# EasyEDA Pro project ProPrj_Embedded Tools_2024-10-02.epro, board Communication
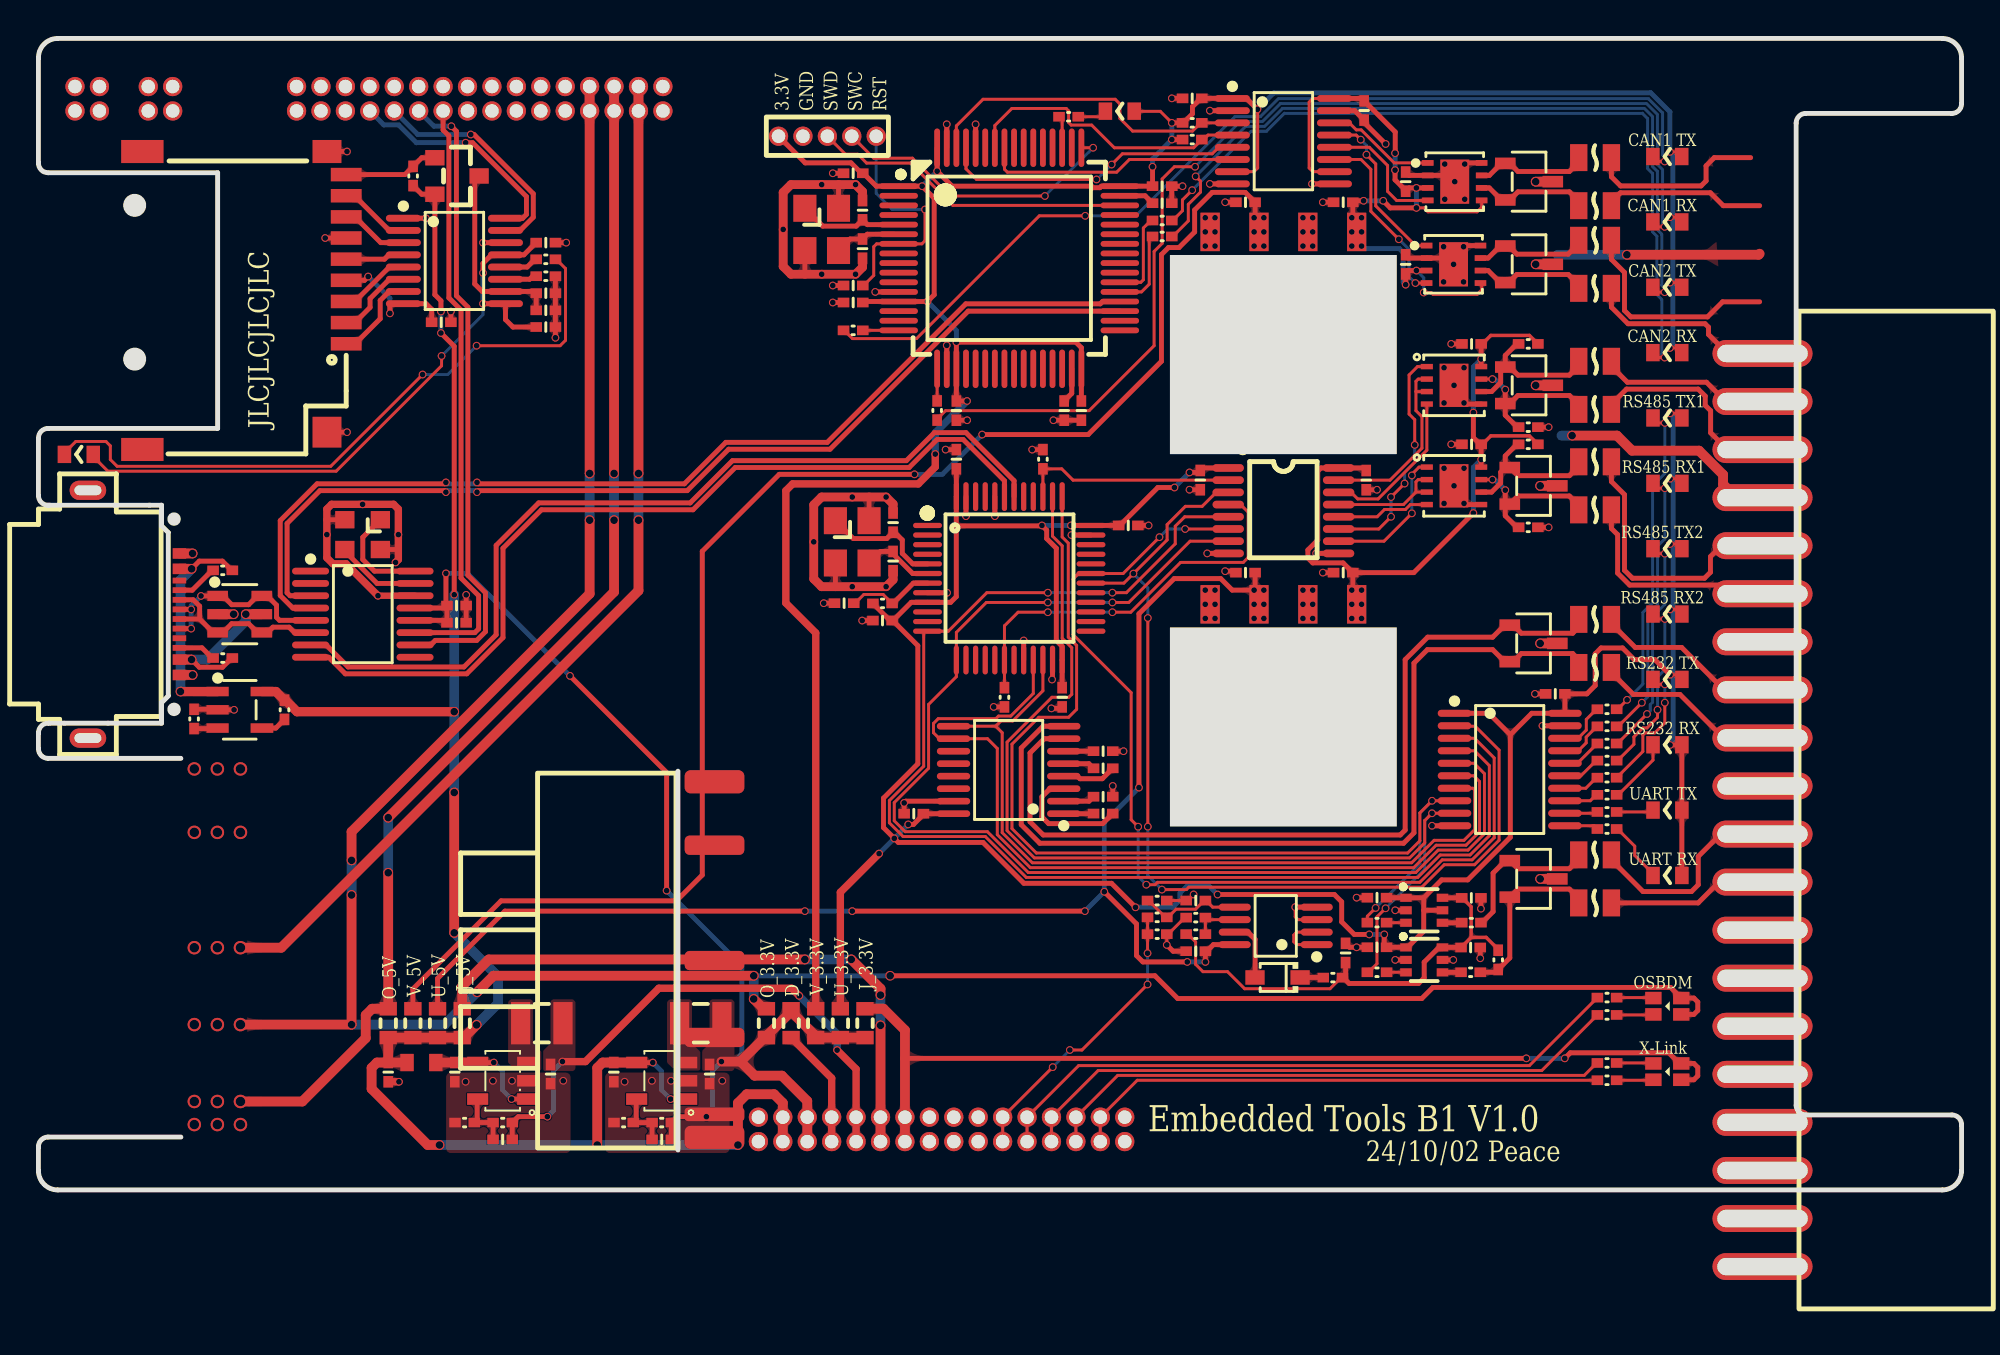
[diagram p11: board, top side]
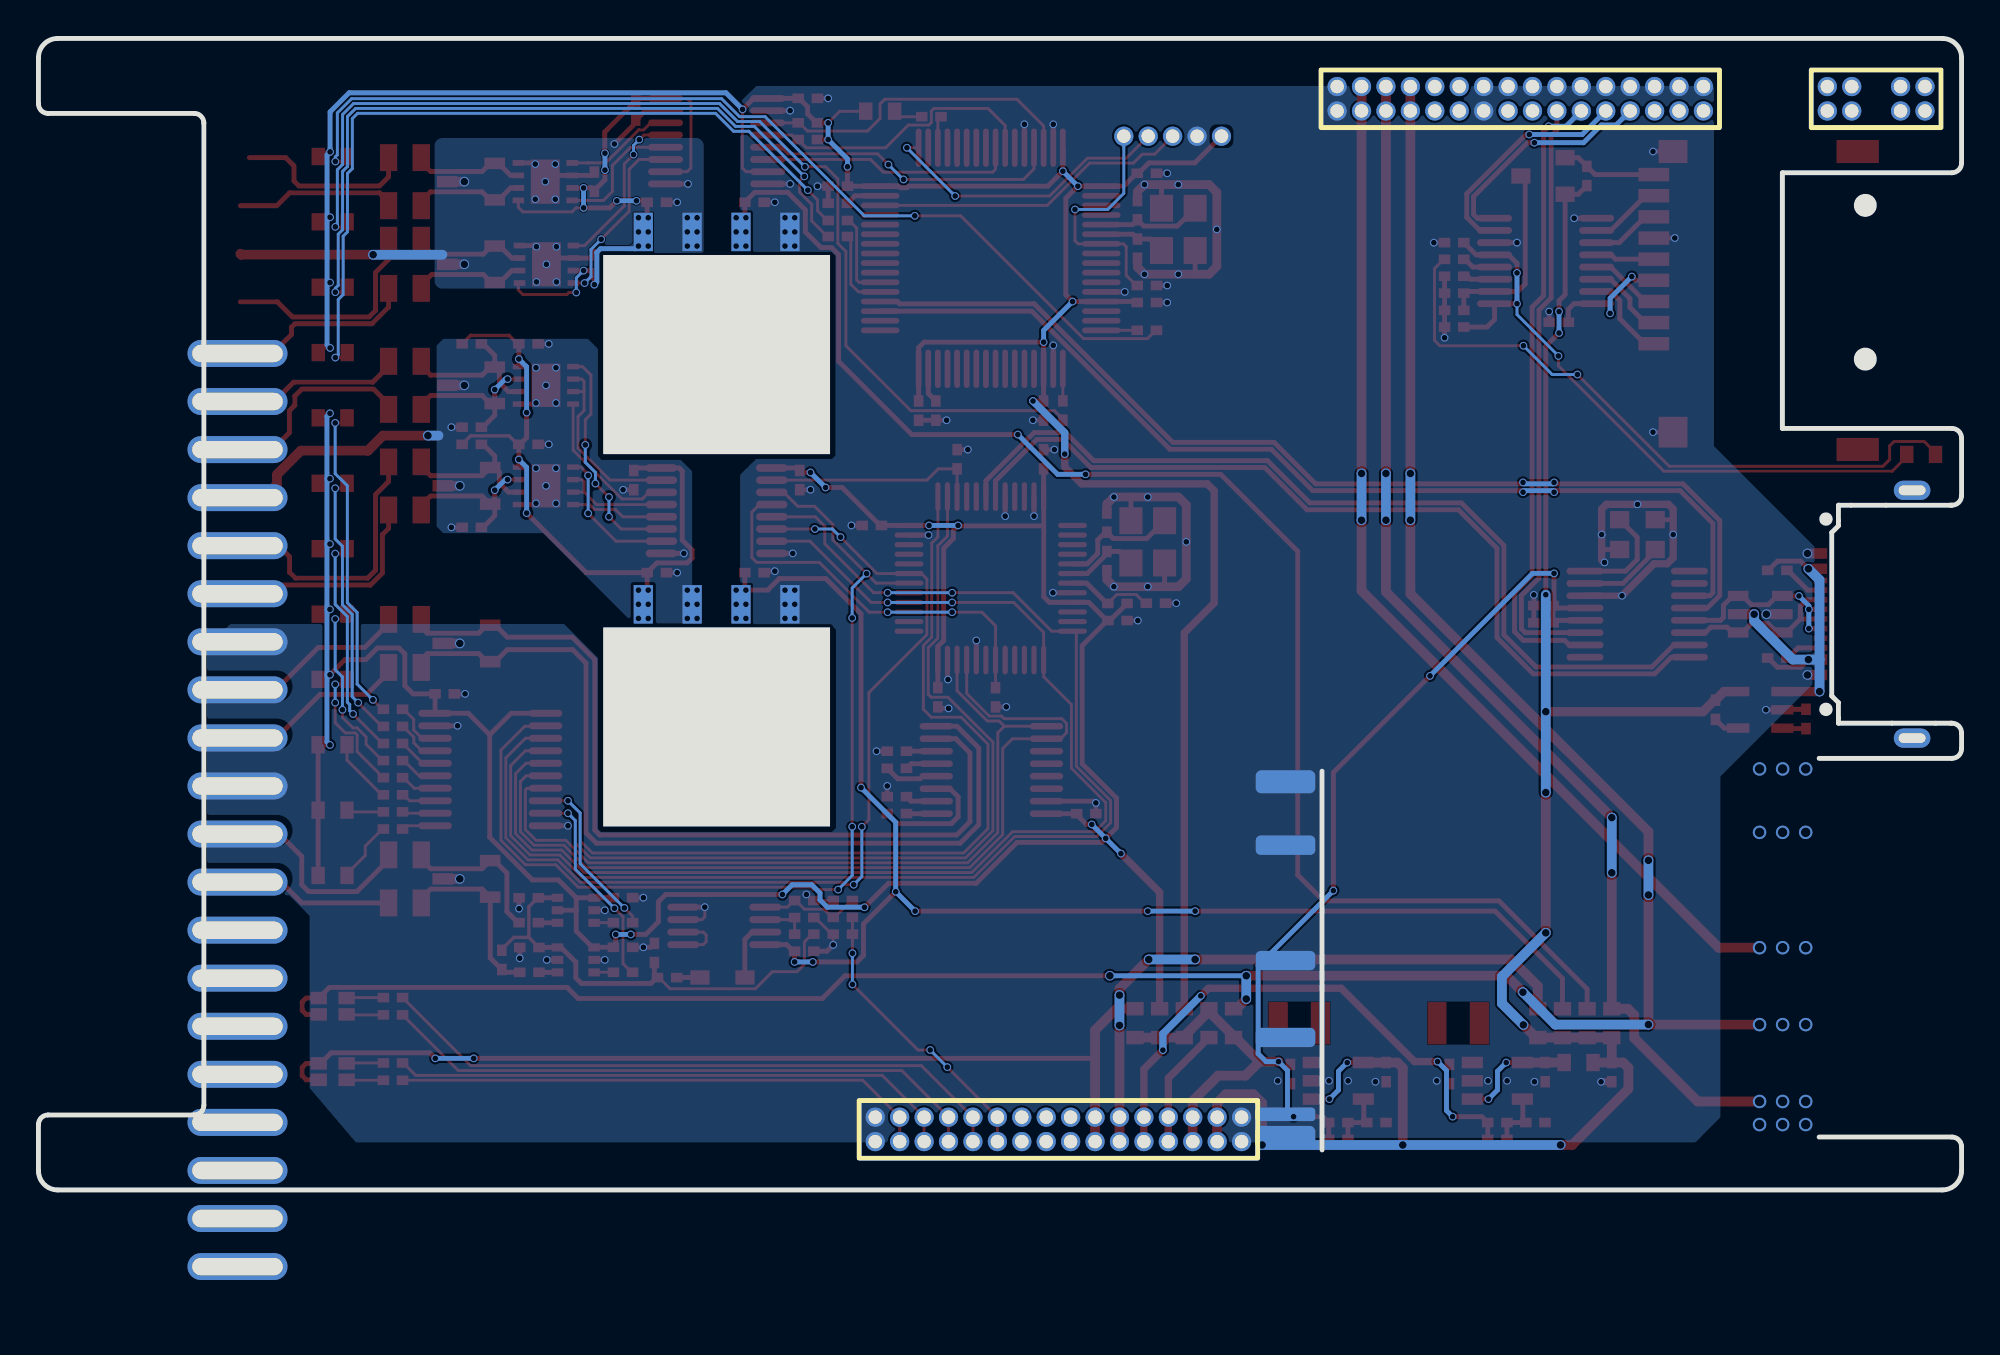
[diagram p12: board, bottom side, seen from below]

Outline 100 x 59.9 mm; copper layers: Top Layer, Bottom Layer. Coordinates in mm from the lower left corner of the outline.
Outline path: 7.4,22.45 0.5,22.45 arc(0.15,22.6) 0,22.95 0,23.78 arc(0.15,24.13) 0.5,24.28 0.57,24.28 ; 7.4,2.75 0.5,2.75 arc(0.15,2.6) 0,2.25 0,1 arc(0.29,0.29) 1,0 99,0 arc(99.71,0.29) 100,1 100,3.4 arc(99.85,3.75) 99.5,3.9 91.9,3.9 arc(91.55,4.05) 91.4,4.4 91.4,55.5 arc(91.55,55.85) 91.9,56 99.5,56 arc(99.85,56.15) 100,56.5 100,58.9 arc(99.71,59.61) 99,59.9 1,59.9 arc(0.29,59.61) 0,58.9 0,53.41 arc(0.15,53.06) 0.5,52.91 9.32,52.91 9.32,39.61 0.5,39.61 arc(0.15,39.47) 0,39.11 0,36.12 arc(0.15,35.77) 0.5,35.62 0.57,35.62
Stack: Top Layer 0.035mm / Dielectric1 1.51mm FR4 er 4.5 / Bottom Layer 0.035mm

## Design rules (mm)
template: 双面板
spacing copperThickness1oz (default): track to track 0.102, other pairs 0.102 to 0.201
spacing copperThickness2oz: track to track 0.203, other pairs 0.152 to 0.3
track width copperThickness1oz (default): min 0.102, default 0.254, max 2.54
track width copperThickness2oz: min 0.203, default 0.254, max 2.54
differential pair differentialPair (default): width min 0.127, default 0.254, max 2.54; gap min 0.152, default 0.152
via viaSize (default): diameter min 0.399, default 0.399, max 10; hole min 0.3, default 0.3, max 6.299

## Placement (name value [footprint] x y rotation side)
B1  600Ω  [L0603]  19.91 6.63 0 top
C1  100nF  [C0402]  42.36 52.89 0 top
C2  2.2uF  [C0402]  47.73 40.54 270 top
C3  100nF  [C0402]  54.23 40.54 90 top
C4  100nF  [C0402]  58.43 52.22 180 top
C5  100nF  [C0402]  42.36 46.16 0 top
C6  2.2uF  [C0402]  58.43 51.33 180 top
C7  10pF  [C0402]  42.85 50.97 90 top
C8  10pF  [C0402]  42.85 48.97 90 top
C9  2.2uF  [C0402]  53.34 40.54 90 top
C10  100nF  [C0402]  42.36 47.05 180 top
C11  100nF  [C0402]  59.99 56.78 0 top
C12  100nF  [C0402]  71.09 52.45 90 top
C13  100nF  [C0402]  71.09 48.15 90 top
C14  100nF  [C0402]  68.94 56.15 270 top
C15  4.7uF  [C0402]  62.77 51.38 0 top
C16  10uF  [C0402]  67.85 51.38 0 top
C17  10pF  [C0402]  44.44 32.71 90 top
C18  10pF  [C0402]  44.44 34.71 90 top
C19  100nF  [C0402]  78.88 25.81 0 top
C20  100nF  [C0402]  43.89 29.62 0 top
C21  100nF  [C0402]  53.23 25.63 90 top
C22  100nF  [C0402]  41.89 30.52 0 top
C23  100nF  [C0402]  56.67 34.57 180 top
C24  100nF  [C0402]  47.73 38.01 270 top
C25  100nF  [C0402]  60.41 36.93 90 top
C26  4.7uF  [C0402]  62.77 32.11 0 top
C27  100nF  [C0402]  55.36 19.58 0 top
C28  100nF  [C0402]  55.36 20.46 0 top
C29  100nF  [C0402]  55.36 21.93 180 top
C30  100nF  [C0402]  55.36 22.82 0 top
C31  10uF  [C0402]  67.85 32.11 0 top
C32  100nF  [C0402]  60.18 15.05 0 top
C33  100nF  [C0402]  69.04 36.92 270 top
C34  100nF  [C0402]  69.6 15.2 0 top
C35  100nF  [C0402]  69.6 12.62 0 top
C36  100nF  [C0402]  45.52 19.57 180 top
C37  100nF  [C0402]  74.51 15.19 180 top
C38  100nF  [C0402]  74.47 12.61 180 top
C39  2.2uF  [C0402]  67.97 12.33 270 top
C40  100nF  [C0402]  74.52 44.01 180 top
C41  100nF  [C0402]  74.52 38.79 180 top
C42  100nF  [C0402]  60.18 12.42 180 top
C43  10uF  [C0402]  26.38 45.76 180 top
C44  100nF  [C0402]  26.38 46.65 0 top
C45  10uF  [C0402]  26.38 49.28 180 top
C46  100nF  [C0402]  26.38 44.89 0 top
C47  100nF  [C0402]  20.95 45.14 180 top
C48  10uF  [C0402]  21.74 30.4 180 top
C49  100nF  [C0402]  21.74 29.5 180 top
C50  100nF  [C0402]  18.19 6.13 90 top
C51  4.7uF  [C0402]  29.92 6.13 90 top
C52  4.7uF  [C0402]  21.65 6.13 90 top
C53  10pF  [C0402]  32.41 2.63 0 top
C54  10pF  [C0402]  24.14 2.63 0 top
C55  10uF  [C0402]  34.9 6.03 90 top
C56  10uF  [C0402]  26.63 6.03 90 top
CARD1  TF PUSH  [TF-SMD_TF-PUSH]  10.7 46.27 270 top
CN1  KF2EDGV-2.5-20P  [CONN-TH_20P-P2.50_KF2EDGV-2.5-20P_SMD]  89.5 29.95 0 top
D1  SM712  [SOT-23-3_L2.9-W1.6-P1.90-LS2.8-BR]  77.51 52.45 180 top
D2  SM712  [SOT-23-3_L2.9-W1.6-P1.90-LS2.8-BR]  77.51 48.15 180 top
D3  1N5819WS  [SOD-323_L1.8-W1.3-LS2.5-RD]  64.43 11.05 180 top
D4  USBLC6-2SC6  [SOT-23-6_L2.9-W1.6-P0.95-LS2.8-BL]  10.47 29.95 270 top
D5  -  [LED1615]  84.7 9.56 0 top
D6  -  [LED1615]  84.7 6.16 0 top
F1  fe1784bef1244946a9952536cf903c7f  [F0805]  80.94 53.7 0 top
F2  fe1784bef1244946a9952536cf903c7f  [F0805]  80.94 51.2 0 top
F3  fe1784bef1244946a9952536cf903c7f  [F0805]  80.94 49.4 0 top
F4  fe1784bef1244946a9952536cf903c7f  [F0805]  80.94 46.9 0 top
F5  fe1784bef1244946a9952536cf903c7f  [F0805]  80.94 27.18 0 top
F6  fe1784bef1244946a9952536cf903c7f  [F0805]  80.94 29.68 0 top
F7  fe1784bef1244946a9952536cf903c7f  [F0805]  80.94 17.43 0 top
F8  fe1784bef1244946a9952536cf903c7f  [F0805]  80.94 14.93 0 top
F9  fe1784bef1244946a9952536cf903c7f  [F0805]  80.94 40.61 0 top
F10  fe1784bef1244946a9952536cf903c7f  [F0805]  80.94 43.11 0 top
F11  fe1784bef1244946a9952536cf903c7f  [F0805]  80.94 35.38 0 top
F12  fe1784bef1244946a9952536cf903c7f  [F0805]  80.94 37.88 0 top
L1  2.2uH  [IND-SMD_L2.5-W2.0_MHCHL2520]  34.44 8.67 0 top
L2  2.2uH  [IND-SMD_L2.5-W2.0_MHCHL2520]  26.17 8.67 0 top
LED1  BLUE  [LED0603]  84.7 53.75 0 top
LED2  YELLOW  [LED0603]  84.7 50.35 0 top
LED3  BLUE  [LED0603]  84.7 46.95 0 top
LED4  YELLOW  [LED0603]  84.7 43.55 0 top
LED5  WHITE  [LED0603]  56.23 56.11 0 top
LED6  BLUE  [LED0603]  84.71 40.15 0 top
LED7  YELLOW  [LED0603]  84.71 36.75 0 top
LED8  BLUE  [LED0603]  84.71 33.35 0 top
LED9  YELLOW  [LED0603]  84.71 29.95 0 top
LED10  BLUE  [LED0603]  84.71 26.55 0 top
LED11  YELLOW  [LED0603]  84.71 23.15 0 top
LED12  BLUE  [LED0603]  84.71 19.75 0 top
LED13  YELLOW  [LED0603]  84.71 16.35 0 top
LED14  WHITE  [LED0603]  2.1 38.25 0 top
NOREF  -  [Pad_e732]  60.93 49.84 0 top
NOREF#2  -  [Pad_e1746]  60.93 30.47 0 top
NOREF#3  -  [Pad_e1748]  66.01 30.47 0 top
NOREF#4  -  [Pad_e1747]  63.47 30.47 0 top
NOREF#5  -  [Pad_e735]  68.55 49.84 0 top
NOREF#6  -  [Pad_e1749]  68.55 30.47 0 top
NOREF#7  -  [Pad_e733]  63.47 49.84 0 top
NOREF#8  -  [Pad_e734]  66.01 49.84 0 top
P1  dc5cb5f8908149b6a9bd9e7172c1ed3e  [HDR-TH_5P-P1.27-V-M]  41.02 54.81 0 top
P2  BX-PM1.27-2-5PU  [HDR-TH_10P-P1.27-V-F-R2-C5-S1.27_1]  4.44 56.76 0 bottom
P3  27a93d4c6a1a4b3c8a68780d97aa3357  [HDR-TH_32P-P1.27-V-F-R2-C16-S1.27]  46.96 3.15 0 bottom
P4  27a93d4c6a1a4b3c8a68780d97aa3357  [HDR-TH_32P-P1.27-V-F-R2-C16-S1.27]  22.95 56.76 0 bottom
Q1  AO3401A  [SOT-23_L2.9-W1.3-P1.90-LS2.4-BR]  21.76 52.75 180 top
R1  1K  [R0402]  42.36 44.72 180 top
R2  1K  [R0402]  46.73 40.55 270 top
R3  1K  [R0402]  58.43 49.6 0 top
R4  1K  [R0402]  58.43 50.43 0 top
R5  1K  [R0402]  53.57 55.83 0 top
R6  100K  [R0402]  59.99 55.51 180 top
R7  100K  [R0402]  59.99 54.64 180 top
R8  10K  [R0402]  43.89 30.51 180 top
R9  1K  [R0402]  81.57 25 180 top
R10  1K  [R0402]  81.57 24.11 180 top
R11  1K  [R0402]  81.57 23.22 180 top
R12  1K  [R0402]  81.57 22.33 180 top
R13  1K  [R0402]  81.57 21.44 180 top
R14  1K  [R0402]  81.57 20.55 180 top
R15  1K  [R0402]  81.57 19.66 180 top
R16  1K  [R0402]  81.57 18.77 180 top
R17  100K  [R0402]  52.23 38.01 270 top
R18  100K  [R0402]  50.23 25.63 90 top
R19  1K  [R0402]  58.17 13.31 0 top
R20  10K  [R0402]  58.17 14.18 0 top
R21  100K  [R0402]  58.17 15.05 0 top
R22  220R  [R0402]  69.6 13.9 0 top
R23  220R  [R0402]  69.6 11.32 0 top
R24  10K  [R0402]  60.18 13.31 0 top
R25  10K  [R0402]  60.18 14.17 180 top
R26  100R  [R0402]  74.51 13.9 0 top
R27  100R  [R0402]  74.47 11.32 0 top
R28  100R  [R0402]  67.31 11.05 180 top
R29  100K  [R0402]  75.9 11.97 270 top
R30  10K  [R0402]  77.47 44.01 0 top
R31  10K  [R0402]  77.47 39.68 180 top
R32  10K  [R0402]  77.47 38.79 0 top
R33  10K  [R0402]  77.47 34.47 180 top
R34  100K  [R0402]  19.48 52.75 270 top
R35  1K  [R0402]  26.38 47.53 0 top
R36  1K  [R0402]  26.38 48.41 0 top
R37  100K  [R0402]  32.41 3.51 0 top
R38  22K  [R0402]  30.43 3.51 0 top
R39  200K  [R0402]  24.14 3.51 0 top
R40  100K  [R0402]  22.16 3.51 0 top
R41  56K  [R0402]  9.58 27.67 180 top
R42  56K  [R0402]  9.58 32.23 180 top
R43  100K  [R0402]  12.79 24.98 90 top
R44  12K  [R0402]  8.09 24.5 270 top
R45  0R  [R0603]  19.47 8.67 270 top
R46  0R  [R0603]  40.42 8.67 270 top
R47  0R  [R0603]  20.75 8.67 270 top
R48  0R  [R0603]  41.7 8.67 270 top
R49  0R  [R0603]  18.19 8.67 270 top
R50  0R  [R0603]  37.86 8.67 270 top
R51  0R  [R0603]  22.03 8.67 270 top
R52  0R  [R0603]  42.98 8.67 270 top
R53  0R  [R0603]  39.14 8.67 90 top
R54  1K  [R0402]  81.57 9.1 180 top
R55  1K  [R0402]  81.57 10.01 180 top
R56  1K  [R0402]  81.57 5.7 180 top
R57  1K  [R0402]  81.57 6.61 180 top
SW1  SS23H37L4  [SW-TH_SS23H37LX_SMD]  9.3 12.6 0 top
U1  SIT1057TK/3  [DFN-8_L3.0-W3.0-P0.65-BL-EP-1]  73.65 52.45 270 top
U2  SIT1057TK/3  [DFN-8_L3.0-W3.0-P0.65-BL-EP-1]  73.58 48.15 270 top
U3  CA-IS3742HB  [SSOP-16_L4.9-W3.9-P0.64-LS6.0-BL]  64.74 54.56 270 top
U4  B0505S-1WR3  [PWRM-TH_B0503S-1WR2_S_1]  64.74 48.69 0 top
U5  74HC245KAJ  [TSSOP-20_L6.5-W4.4-P0.65-LS6.4-BL]  76.5 21.87 270 top
U6  CH344Q  [LQFP-48_L7.0-W7.0-P0.50-LS9.0-BL]  50.48 31.82 270 top
U7  CA-IS3762HB  [SSOP-16_L4.9-W3.9-P0.64-LS6.0-BL-1]  64.74 35.34 270 top
U8  B0505S-1WR3  [PWRM-TH_B0503S-1WR2_S_1]  64.74 29.32 0 top
U9  SP3232EEY-L/TR  [TSSOP-16_L5.0-W4.4-P0.65-LS6.4-BL]  50.45 21.85 90 top
U10  74LVC1T45DW-7  [SC-70-6_L2.2-W1.3-P0.65-LS2.1-BR]  72.06 14.55 180 top
U11  74LVC1T45DW-7  [SC-70-6_L2.2-W1.3-P0.65-LS2.1-BR]  72.06 11.97 180 top
U12  SIT3088ETK  [DFN-8_L3.0-W3.0-P0.65-BL-EP]  73.61 41.86 270 top
U13  SIT3088ETK  [DFN-8_L3.0-W3.0-P0.65-BL-EP]  73.61 36.63 270 top
U14  SDT23C712L02  [SOT-23-3_L2.9-W1.6-P1.90-LS2.8-BR]  77.74 28.43 180 top
U15  ESDA5V3L  [SOT-23-3_L2.9-W1.6-P1.90-LS2.8-BR]  77.74 16.18 180 top
U16  SM712  [SOT-23-3_L2.9-W1.6-P1.90-LS2.8-BR]  77.51 41.86 180 top
U17  SM712  [SOT-23-3_L2.9-W1.6-P1.90-LS2.8-BR]  77.74 36.63 180 top
U18  GL823K-HCY04  [SSOP-16_L4.9-W3.9-P0.64-LS6.0-BL]  21.63 48.33 270 top
U19  CH334R  [QSOP-16_L4.9-W3.9-P0.64-LS6.0-BL]  16.87 29.95 270 top
U20  TLV62568DBVR  [SOT-23-5_L3.0-W1.7-P0.95-LS2.8-BR]  32.41 5.68 0 top
U21  TLV62568DBVR  [SOT-23-5_L3.0-W1.7-P0.95-LS2.8-BR]  24.14 5.68 0 top
U22  SY6280AAC  [SOT-23-5_L3.0-W1.7-P0.95-LS2.8-BL]  10.47 24.98 270 top
U23  STM32F405RGT6  [LQFP-64_L10.0-W10.0-P0.50-LS12.0-BL]  50.48 48.47 270 top
U24  LMV358AIDGKR  [VSSOP-8_L3.0-W3.0-P0.65-LS5.0-BL]  64.34 13.74 90 top
USB1  USB31-TYPEC-16X7C-1FS  [USB-SMD_USB31-TYPEC-16X7C-1FS]  4.95 29.95 270 top
X1  8MHz  [CRYSTAL-SMD_4P-L3.2-W2.5-BL-A]  40.73 49.97 270 top
X2  8MHz  [CRYSTAL-SMD_4P-L3.2-W2.5-BL-A]  42.32 33.71 270 top
X3  12MHz  [CRYSTAL-SMD_4P-L2.5-W2.0-BL-A]  16.85 34.09 180 top

## Footprints (pads in the part's own frame, mm; a bottom-side part is the same pattern mirrored in y, then rotated)
C0402
  rect 0.6x0.5 smd: 1(-0.5,0) 2(0.5,0)
CONN-TH_20P-P2.50_KF2EDGV-2.5-20P_SMD
  oval 5.2x1.4 hole 4.7x0.9: 1(0.15,13.563) 2(0.15,11.063) 3(0.15,8.563) 4(0.15,6.063) 5(0.15,3.563) 6(0.15,1.063) 7(0.15,-1.437) 8(0.15,-3.937) 9(0.15,-6.437) 10(0.15,-8.937) 11(0.15,-11.437) 12(0.15,-13.937) 13(0.15,-16.437) 14(0.15,-18.937) 15(0.15,-21.437) 16(0.15,-23.937) 17(0.15,-26.437) 18(0.15,-28.937) 19(0.15,-31.437) 20(0.15,-33.937)
CRYSTAL-SMD_4P-L2.5-W2.0-BL-A
  rect 1x0.9 smd: 1(-0.925,-0.775) 2(0.925,-0.775) 3(0.925,0.775) 4(-0.925,0.775)
CRYSTAL-SMD_4P-L3.2-W2.5-BL-A
  rect 1.4x1.2 smd: 1(-1.1,-0.875) 2(1.1,-0.875) 3(1.1,0.875) 4(-1.1,0.875)
DFN-8_L3.0-W3.0-P0.65-BL-EP
  rect 0.28x0.625 smd: 1(-0.975,-1.413) 2(-0.325,-1.413) 3(0.325,-1.413) 4(0.975,-1.413) 5(0.975,1.413) 6(0.325,1.413) 7(-0.325,1.413) 8(-0.975,1.413)
  rect 2.25x1.5 smd: 9(0,0)
DFN-8_L3.0-W3.0-P0.65-BL-EP-1
  rect 0.3x0.6 smd: 1(-0.975,-1.4) 2(-0.325,-1.4) 3(0.325,-1.4) 4(0.975,-1.4) 5(0.975,1.4) 6(0.325,1.4) 7(-0.325,1.4) 8(-0.975,1.4)
  rect 2.3x1.5 smd: 9(0,0)
F0805
  rect 0.9x1.4 smd: 1(-0.85,0) 2(0.85,0)
HDR-TH_5P-P1.27-V-M
  rrect 1x1 hole 0.7: 1(-2.54,0)
  round 1 hole 0.7: 2(-1.27,0) 3(0,0) 4(1.27,0) 5(2.54,0)
HDR-TH_10P-P1.27-V-F-R2-C5-S1.27_1
  rrect 1x1 hole 0.7: 1(-2.54,-0.635)
  round 1 hole 0.7: 2(-2.54,0.635) 3(-1.27,-0.635) 4(-1.27,0.635) 7(1.27,-0.635) 8(1.27,0.635) 9(2.54,-0.635) 10(2.54,0.635)
HDR-TH_32P-P1.27-V-F-R2-C16-S1.27
  rrect 1x1 hole 0.7: 1(-9.525,-0.635)
  round 1 hole 0.7: 2(-9.525,0.635) 3(-8.255,-0.635) 4(-8.255,0.635) 5(-6.985,-0.635) 6(-6.985,0.635) 7(-5.715,-0.635) 8(-5.715,0.635) 9(-4.445,-0.635) 10(-4.445,0.635) 11(-3.175,-0.635) 12(-3.175,0.635) 13(-1.905,-0.635) 14(-1.905,0.635) 15(-0.635,-0.635) 16(-0.635,0.635) 17(0.635,-0.635) 18(0.635,0.635) 19(1.905,-0.635) 20(1.905,0.635) 21(3.175,-0.635) 22(3.175,0.635) 23(4.445,-0.635) 24(4.445,0.635) 25(5.715,-0.635) 26(5.715,0.635) 27(6.985,-0.635) 28(6.985,0.635) 29(8.255,-0.635) 30(8.255,0.635) 31(9.525,-0.635) 32(9.525,0.635)
IND-SMD_L2.5-W2.0_MHCHL2520
  rect 1x2.2 smd: 1(-1.1,0) 2(1.1,0)
L0603
  rect 0.7x0.9 smd: 1(-0.75,0) 2(0.75,0)
LED0603
  rect 0.7x0.9 smd: 1(-0.75,0.008) 2(0.75,0.008)
LED1615
  rect 0.85x0.65 smd: 1(-0.725,0.425) 2(-0.725,-0.425) 3(0.725,-0.425) 4(0.725,0.425)
LQFP-48_L7.0-W7.0-P0.50-LS9.0-BL
  oval 0.27x1.5 smd: 1(-2.75,-4.25) 2(-2.25,-4.25) 3(-1.75,-4.25) 4(-1.25,-4.25) 5(-0.75,-4.25) 6(-0.25,-4.25) 7(0.25,-4.25) 8(0.75,-4.25) 9(1.25,-4.25) 10(1.75,-4.25) 11(2.25,-4.25) 12(2.75,-4.25) 25(2.75,4.25) 26(2.25,4.25) 27(1.75,4.25) 28(1.25,4.25) 29(0.75,4.25) 30(0.25,4.25) 31(-0.25,4.25) 32(-0.75,4.25) 33(-1.25,4.25) 34(-1.75,4.25) 35(-2.25,4.25) 36(-2.75,4.25)
  oval 1.5x0.27 smd: 13(4.25,-2.75) 14(4.25,-2.25) 15(4.25,-1.75) 16(4.25,-1.25) 17(4.25,-0.75) 18(4.25,-0.25) 19(4.25,0.25) 20(4.25,0.75) 21(4.25,1.25) 22(4.25,1.75) 23(4.25,2.25) 24(4.25,2.75) 37(-4.25,2.75) 38(-4.25,2.25) 39(-4.25,1.75) 40(-4.25,1.25) 41(-4.25,0.75) 42(-4.25,0.25) 43(-4.25,-0.25) 44(-4.25,-0.75) 45(-4.25,-1.25) 46(-4.25,-1.75) 47(-4.25,-2.25) 48(-4.25,-2.75)
LQFP-64_L10.0-W10.0-P0.50-LS12.0-BL
  oval 0.3x2 smd: 1(-3.75,-5.75) 2(-3.25,-5.75) 3(-2.75,-5.75) 4(-2.25,-5.75) 5(-1.75,-5.75) 6(-1.25,-5.75) 7(-0.75,-5.75) 8(-0.25,-5.75) 9(0.25,-5.75) 10(0.75,-5.75) 11(1.25,-5.75) 12(1.75,-5.75) 13(2.25,-5.75) 14(2.75,-5.75) 15(3.25,-5.75) 16(3.75,-5.75) 33(3.75,5.75) 34(3.25,5.75) 35(2.75,5.75) 36(2.25,5.75) 37(1.75,5.75) 38(1.25,5.75) 39(0.75,5.75) 40(0.25,5.75) 41(-0.25,5.75) 42(-0.75,5.75) 43(-1.25,5.75) 44(-1.75,5.75) 45(-2.25,5.75) 46(-2.75,5.75) 47(-3.25,5.75) 48(-3.75,5.75)
  oval 2x0.3 smd: 17(5.75,-3.75) 18(5.75,-3.25) 19(5.75,-2.75) 20(5.75,-2.25) 21(5.75,-1.75) 22(5.75,-1.25) 23(5.75,-0.75) 24(5.75,-0.25) 25(5.75,0.25) 26(5.75,0.75) 27(5.75,1.25) 28(5.75,1.75) 29(5.75,2.25) 30(5.75,2.75) 31(5.75,3.25) 32(5.75,3.75) 49(-5.75,3.75) 50(-5.75,3.25) 51(-5.75,2.75) 52(-5.75,2.25) 53(-5.75,1.75) 54(-5.75,1.25) 55(-5.75,0.75) 56(-5.75,0.25) 57(-5.75,-0.25) 58(-5.75,-0.75) 59(-5.75,-1.25) 60(-5.75,-1.75) 61(-5.75,-2.25) 62(-5.75,-2.75) 63(-5.75,-3.25) 64(-5.75,-3.75)
Pad_e732
  rect 1x2 smd far side: 1(0,0)
Pad_e733
  rect 1x2 smd far side: 1(0,0)
Pad_e734
  rect 1x2 smd far side: 1(0,0)
Pad_e735
  rect 1x2 smd far side: 1(0,0)
Pad_e1746
  rect 1x2 smd far side: 1(0,0)
Pad_e1747
  rect 1x2 smd far side: 1(0,0)
Pad_e1748
  rect 1x2 smd far side: 1(0,0)
Pad_e1749
  rect 1x2 smd far side: 1(0,0)
PWRM-TH_B0503S-1WR2_S_1
  rect 1x2 smd: 1(-3.81,1.15) 2(-1.27,1.15) 3(1.27,1.15) 4(3.81,1.15)
QSOP-16_L4.9-W3.9-P0.64-LS6.0-BL
  oval 0.35x1.921 smd: 1(-2.24,-2.716) 2(-1.6,-2.716) 3(-0.96,-2.716) 4(-0.32,-2.716) 5(0.32,-2.716) 6(0.96,-2.716) 7(1.6,-2.716) 8(2.24,-2.716) 9(2.24,2.716) 10(1.6,2.716) 11(0.96,2.716) 12(0.32,2.716) 13(-0.32,2.716) 14(-0.96,2.716) 15(-1.6,2.716) 16(-2.24,2.716)
R0402
  rect 0.6x0.5 smd: 1(-0.5,0) 2(0.5,0)
R0603
  rect 0.7x0.9 smd: 1(-0.75,0) 2(0.75,0)
SC-70-6_L2.2-W1.3-P0.65-LS2.1-BR
  rect 0.6x0.42 smd: 1(0.95,-0.65) 2(0.95,0) 3(0.95,0.65) 4(-0.95,0.65) 5(-0.95,0) 6(-0.95,-0.65)
SOD-323_L1.8-W1.3-LS2.5-RD
  rect 1x0.75 smd: 1(-1.173,0) 2(1.173,0)
SOT-23-3_L2.9-W1.6-P1.90-LS2.8-BR
  rect 1.07x0.6 smd: 1(1.235,-0.95) 2(1.235,0.95) 3(-1.235,0)
SOT-23-5_L3.0-W1.7-P0.95-LS2.8-BL
  rect 0.49x1.157 smd: 1(-0.95,-1.153) 2(0,-1.153) 3(0.95,-1.153)
  rect 0.49x1.175 smd: 4(0.95,1.153) 5(-0.95,1.153)
SOT-23-5_L3.0-W1.7-P0.95-LS2.8-BR
  rect 1.1x0.6 smd: 1(1.3,-0.95) 2(1.3,0) 3(1.3,0.95) 4(-1.3,0.95) 5(-1.3,-0.95)
SOT-23-6_L2.9-W1.6-P0.95-LS2.8-BL
  rect 0.532x1.072 smd: 1(-0.95,-1.149) 2(0,-1.149) 3(0.95,-1.149) 4(0.95,1.149) 5(0,1.149) 6(-0.95,1.149)
SOT-23_L2.9-W1.3-P1.90-LS2.4-BR
  rect 1x0.8 smd: 1(1.15,-0.95) 2(1.15,0.95) 3(-1.15,0)
SSOP-16_L4.9-W3.9-P0.64-LS6.0-BL
  oval 0.355x1.815 smd: 1(-2.223,-2.655) 2(-1.587,-2.655) 3(-0.953,-2.655) 4(-0.318,-2.655) 5(0.318,-2.655) 6(0.953,-2.655) 7(1.587,-2.655) 8(2.223,-2.655) 9(2.223,2.655) 10(1.587,2.655) 11(0.953,2.655) 12(0.318,2.655) 13(-0.318,2.655) 14(-0.953,2.655) 15(-1.587,2.655) 16(-2.223,2.655)
SSOP-16_L4.9-W3.9-P0.64-LS6.0-BL-1
  oval 0.4x1.63 smd: 1(-2.223,-2.87) 2(-1.587,-2.87) 3(-0.953,-2.87) 4(-0.318,-2.87) 5(0.318,-2.87) 6(0.953,-2.87) 7(1.587,-2.87) 8(2.223,-2.87) 9(2.223,2.87) 10(1.587,2.87) 11(0.953,2.87) 12(0.318,2.87) 13(-0.318,2.87) 14(-0.953,2.87) 15(-1.587,2.87) 16(-2.223,2.87)
SW-TH_SS23H37LX_SMD
  rrect 3.1x1 smd far side: 1(25.85,5.331) 2(25.85,-0.669) 3(25.85,-4.669)
  rrect 3.1x0.7 smd far side: 4(25.85,-8.669)
  rrect 3.1x0.7 smd: 5(25.85,-8.669)
  rrect 3.1x1 smd: 6(25.85,-4.669) 7(25.85,-0.669) 8(25.85,5.331)
  rrect 3.1x1.2 smd: 9(25.85,8.631) 10(25.85,-9.869)
  rrect 3.1x1.2 smd far side: 11(25.85,-9.869) 12(25.85,8.631)
TF-SMD_TF-PUSH
  rect 0.7x1.6 smd: 1(2.25,5.3) 2(1.15,5.3) 3(0.05,5.3) 4(-1.05,5.3) 5(-2.15,5.3) 6(-3.25,5.3) 7(-4.35,5.3) 8(-5.45,5.3) CD(-6.55,5.3)
  rect 1.2x1.5 smd: 10(-7.75,4.3)
  rect 1.2x2.2 smd: 11(-7.75,-5.3) 12(7.75,-5.3)
  rect 1.6x1.5 smd: 13(6.85,4.3)
TSSOP-16_L5.0-W4.4-P0.65-LS6.4-BL
  oval 0.343x1.732 smd: 1(-2.275,-2.866) 2(-1.625,-2.866) 3(-0.975,-2.866) 4(-0.325,-2.866) 5(0.325,-2.866) 6(0.975,-2.866) 7(1.625,-2.866) 8(2.275,-2.866) 9(2.275,2.866) 10(1.625,2.866) 11(0.975,2.866) 12(0.325,2.866) 13(-0.325,2.866) 14(-0.975,2.866) 15(-1.625,2.866) 16(-2.275,2.866)
TSSOP-20_L6.5-W4.4-P0.65-LS6.4-BL
  oval 0.364x1.742 smd: 1(-2.925,-2.871) 2(-2.275,-2.871) 3(-1.625,-2.871) 4(-0.975,-2.871) 5(-0.325,-2.871) 6(0.325,-2.871) 7(0.975,-2.871) 8(1.625,-2.871) 9(2.275,-2.871) 10(2.925,-2.871) 11(2.925,2.871) 12(2.275,2.871) 13(1.625,2.871) 14(0.975,2.871) 15(0.325,2.871) 16(-0.325,2.871) 17(-0.975,2.871) 18(-1.625,2.871) 19(-2.275,2.871) 20(-2.925,2.871)
USB-SMD_USB31-TYPEC-16X7C-1FS
  rect 0.55x0.7 smd: 1(-3.16,2.38) 2(-2.36,2.38) 11(2.36,2.38) 12(3.16,2.38)
  rect 0.3x0.7 smd: 3(-1.75,2.38) 4(-1.25,2.38) 5(-0.75,2.38) 6(-0.25,2.38) 7(0.25,2.38) 8(0.75,2.38) 9(1.25,2.38) 10(1.75,2.38)
  oval 1x1.9 hole 0.5x1.4: 13(-6.445,-2.38) 16(6.445,-2.38)
VSSOP-8_L3.0-W3.0-P0.65-LS5.0-BL
  oval 0.364x1.662 smd: 1(-0.975,-2.131) 2(-0.325,-2.131) 3(0.325,-2.131) 4(0.975,-2.131) 5(0.975,2.131) 6(0.325,2.131) 7(-0.325,2.131) 8(-0.975,2.131)

## Nets
As in the schematic, except:
GND: C1.1 C2.2 C3.1 C4.1 C5.1 C6.1 C7.2 C8.1 C9.1 C10.2 C11.1 C15.1 C17.1 C18.2 C19.1 C20.1 C21.1 C22.1 C23.1 C24.1 C25.1 C26.1 C28.2 C30.2 C32.1 C34.1 C35.1 C36.2 C37.1 C38.1 C39.1 C42.2 C43.1 C44.2 C45.1 C46.2 C47.1 C48.1 C49.1 C50.1 C51.1 C52.1 C55.1 C56.1 CARD1.6 CARD1.10 CARD1.13 CN1.11 CN1.14 D4.2 NOREF.1 NOREF#2.1 P1.2 P3.1 P3.2 P3.31 P3.32 P4.1 P4.3 P4.5 P4.7 P4.9 P4.11 P4.13 P4.15 P4.17 P4.19 P4.20 P4.31 P4.32 R17.1 R18.1 R19.2 R21.2 R25.2 R35.2 R38.1 R40.1 R44.1 U3.2 U3.8 U4.1 U5.10 U5.19 U6.8 U6.20 U6.23 U6.35 U6.44 U6.47 U7.8 U8.1 U9.15 U10.2 U11.2 U11.5 U14.3 U15.3 U18.1 U18.14 U19.14 U20.2 U21.2 U22.2 U23.12 U23.18 U23.60 U23.63 U24.3 U24.4 USB1.1 USB1.12 X1.2 X1.4 X2.2 X2.4 X3.2 X3.4
CAN1_H: CN1.1 F1.2
CAN1_L: CN1.2 F2.2
CAN2_H: CN1.4 F3.2
CAN2_L: CN1.5 F4.2
CAN_5V: C12.1 C13.1 C14.1 C16.2 NOREF#5.1 U1.3 U1.5 U2.3 U2.5 U3.10 U3.16 U4.4
CAN_G: C12.2 C13.2 C14.2 C16.1 CN1.3 D1.3 D2.3 NOREF#8.1 U1.2 U1.8 U1.9 U2.2 U2.8 U2.9 U3.9 U3.15 U4.3
RS232_RXD: CN1.13 F5.2
RS232_TXD: CN1.12 F6.2
RS485_5V: C31.2 C33.1 C40.1 C41.1 NOREF#6.1 R30.2 R32.2 U7.16 U8.4 U12.8 U13.8
RS485_A1: CN1.6 F10.2
RS485_A2: CN1.9 F12.2
RS485_B1: CN1.7 F9.2
RS485_B2: CN1.10 F11.2
RS485_G: C31.1 C33.2 C40.2 C41.2 CN1.8 NOREF#3.1 R31.1 R33.1 U7.9 U8.3 U12.5 U12.9 U13.5 U13.9 U16.3 U17.3
U_5V: C26.2 C42.1 NOREF#4.1 R47.1 U8.2 U24.8
UART_RXD: CN1.16 F8.2
UART_TXD: CN1.15 F7.2
V_3.3V: C1.2 C2.1 C3.2 C4.2 C5.2 C11.2 LED1.2 LED2.2 LED3.2 LED4.2 LED5.2 P1.1 R6.2 R7.2 R46.1 U3.1 U3.7 U23.1 U23.13 U23.19 U23.32 U23.48 U23.64
V_5V: C15.2 NOREF#7.1 R45.1 U4.2
V_RST: C10.1 P1.5 U23.7
V_SWC: P1.4 U23.49
V_SWD: P1.3 U23.46

Pads without a net: CARD1 11 12; CN1 17 18 19 20; P3 15 16 17 18 19 20; P4 16 18 21 22 23 24; SW1 1 8 9 10 11 12; U6 1 2 3 4 10 11 14 15 16 17 19 25 26 27 28 29 32 33 34 40 41 45 46; U9 11 12 13 14; U19 1 2 9; U23 2 3 4 8 9 10 11 14 15 20 21 22 23 24 25 26 27 28 29 30 33 34 39 40 41 42 43 44 45 50 52 53 54 55 56 59; USB1 3 9 13 16

## Via types
v1: diameter 0.7, hole 0.5, Top Layer to Bottom Layer, 18 vias
v2: diameter 0.4, hole 0.3, Top Layer to Bottom Layer, 303 vias
v3: diameter 0.5, hole 0.4, Top Layer to Bottom Layer, 41 vias
v4: diameter 0.399, hole 0.299, Top Layer to Bottom Layer, 2 vias

## Routing (per net, layer and track width the routed paths; a pad name or vN(x,y) marks a point on that pad's centre or on a via; arc(x,y) is an arc through that point)
3.3V: length 61
  Top Layer w0.254: v2(32.66,15.57) 32.66,21.72 v2(27.64,26.74) ; C48.2 21.19,30.45 v2(21.19,32.07) ; C48.2 21.11,30.27 U19.13 ; C48.2 C49.2 21.11,29.63 U19.12 ; C53.2 R37.2 33.21,3.81 v2(34.73,3.81)
  Top Layer w0.508: 39.14,9.28 37.94,8.09 37.94,8.01 R50.2 37.76,7.92 36.51,6.68 ; 39.14,9.28 R53.2 ; 39.14,9.28 40.33,8.09 40.33,8.01 R46.2 R48.2 R52.2 ; 36.51,6.68 37.24,5.94 38.66,5.94 39.98,4.63 P3.5 P3.6 ; 36.51,6.68 v2(35.51,6.68)
  Bottom Layer w0.254: v2(27.64,26.74) 22.31,32.07 v2(21.19,32.07) ; v2(34.73,3.81) 35.05,4.13 35.05,6.21 v2(35.51,6.68) 36.17,6.68 36.58,7.09 36.58,11.66 v2(32.66,15.57)
5V: length 103.2
  Top Layer w0.254: v2(32.87,4.73) U20.1 ; v2(20.93,45.69) 20.93,46.25 20.61,46.57 Q1.2 19.93,51.8 R34.2 ; v2(20.93,44.58) 21.62,43.89 v2(21.62,30.96) ; 31.95,6.63 31.11,6.63
  Top Layer w0.482: v3(21.62,24.88) 13.44,24.88 12.85,25.48 R43.2 12.34,25.93 11.62,25.93
  Top Layer w0.508: C50.2 R49.2 R45.2 R47.2 R51.2 ; C50.2 17.6,6.63 17.32,6.35 17.32,5.26 20.24,2.34 v3(20.85,2.34) ; C50.2 B1.1 ; 31.11,6.63 C51.2 29.34,6.63 29.06,6.35 v3(29.06,2.34) ; P3.4 P3.3 38.71,4.52 38.25,4.98 36.83,4.98 36.37,4.52 v3(36.37,2.34) ; 22.12,7.92 v3(22.78,8.59) ; v3(21.62,20.67) v3(21.62,13.37)
  Bottom Layer w0.254: v2(32.87,4.73) 32.4,5.2 32.4,6.17 v2(31.95,6.63) ; v2(20.93,45.69) v2(20.93,44.58)
  Bottom Layer w0.508: v3(21.62,13.37) 23.9,11.09 23.9,9.7 v3(22.78,8.59) ; v3(20.85,2.34) v3(36.37,2.34) ; v2(21.62,30.96) v3(21.62,24.88) v3(21.62,20.67)
GND: length 111.6
  Top Layer w0.152: v2(65.35,14.71) 65.35,14.21 65.5,14.06 U24.3 ; v2(60.07,15.37) 59.75,15.05 C32.1 ; R25.2 59.61,14.17 58.75,13.31 R19.2 v2(58.67,12.75) ; R21.2 59.68,15.05
  Top Layer w0.254: U6.44 v2(49.73,35.05) ; C36.2 v2(45.02,20.13) 45.11,20.22 U9.15 ; v2(16.04,54.02) CARD1.10 ; U6.23 52.73,26.58 v2(52.71,26.55) ; v2(47.17,38.51) C24.1 ; v2(27.44,49.28) C45.1 ; X3.2 14.99,34.87 ; U23.12 v2(43.51,46.72) ; v2(58.67,12.75) 59,12.42 C42.2 ; v2(52.67,25.05) 53.16,25.05 C21.1 ; v2(75.01,14.63) C37.1 ; v2(61.71,32.19) 62.19,32.19 C26.1 ; v2(51.67,38.51) R17.1 ; v2(42.83,29.62) C20.1 ; U6.20 v2(51.23,28.58) ; U23.18 v2(47.23,43.93) ; C6.1 C4.1 v2(59.49,52.22) ; v2(49.67,25.13) R18.1 ; C35.1 v2(68.54,12.62) 68.17,12.62 C39.1 ; v2(70.55,14.55) U10.2 ; 43.19,34.81 43.19,36.05 ; U6.8 v2(47.25,31.07) ; v2(23.12,49.28) U18.14 ; v2(68.54,15.2) C34.1 ; X1.2 39.85,47.63 ; v2(57.73,34.57) C23.1 ; v2(56.42,22.82) C30.2 ; v2(26.88,44.33) C46.2 C43.1 C44.2 R35.2 ; v2(52.78,40.04) C9.1 C3.1 ; v2(59.86,36.43) C25.1 ; v2(65.35,14.71) U24.4 ; v2(73.57,11.97) 73.01,11.97 ; v2(40.84,30.52) C22.1 ; v2(22.24,30.96) C48.1 C49.1 ; v2(41.31,46.16) C5.1 ; v2(14.91,49.52) CARD1.6 ; U6.35 v2(53.72,34.07) ; v2(55.86,21.02) C28.2 ; v2(61.71,51.38) C15.1 ; v2(70.55,11.97) U11.2 ; v2(60.91,56.14) U3.2 ; v2(21.45,45.7) C47.1 ; U23.60 v2(48.73,55.43) ; v2(60.91,52.33) U3.8 ; v2(10.17,24.98) U22.2 9.29,25 R44.1 ; U6.47 v2(48.23,35.05) ; v2(72.47,18.94) 73.63,18.94 ; v2(48.29,40.04) C2.2 ; v2(58.94,56.78) C11.1 ; X3.4 18.71,33.32 ; U23.63 v2(47.23,55.43) ; v2(16.04,39.42) CARD1.13 ; v2(78.21,24.14) U5.19 ; X1.4 41.6,52.3 ; v2(74.97,12.05) C38.1 ; v2(20.14,50.55) U18.1 ; v2(60.77,33.11) U7.8 ; v2(41.31,52.89) C1.1 ; v2(77.82,25.81) C19.1 ; X2.2 41.44,31.38 ; v2(41.31,47.05) C10.2
  Top Layer w0.33: v2(17.66,30.91) U19.14
  Top Layer w0.381: v2(18.57,32.64) 18.71,32.79 v2(18.71,34.09) 18.71,35.42 18.47,35.67 v2(16.85,35.67) 15.24,35.67 14.99,35.42 v2(14.99,34.09) 14.99,32.89 15.31,32.57 15.99,32.57 v2(17.66,30.91) ; v2(18.74,5.63) C50.1
  Top Layer w0.457: C8.1 42.85,48 v2(42.49,47.63) v2(40.73,47.63) 39.13,47.63 38.73,48.04 v2(38.73,49.97) 38.73,51.89 39.13,52.3 v2(40.73,52.3) v2(42.49,52.3) 42.85,51.93 C7.2 ; C18.2 44.44,35.68 v2(44.08,36.05) v2(42.32,36.05) 40.72,36.05 40.31,35.64 v2(40.31,33.71) 40.31,31.79 40.72,31.38 v2(42.32,31.38) v2(44.08,31.38) 44.44,31.75 C17.1
  Top Layer w0.508: v3(78.09,28.43) U14.3 ; v3(78.09,16.18) U15.3 ; USB1.12 v3(8.01,26.79) ; USB1.1 v3(8.01,33.11) ; D4.2 v3(10.15,29.95)
  vias: v2(22.21,5.63) v2(23.63,5.68) v2(24.62,5.68) v2(27.29,5.68) v2(30.48,5.63) v2(31.9,5.68) v2(32.89,5.68) v2(35.56,5.68) v2(60.67,50.57) v2(60.67,49.84) v2(60.67,49.1) v2(60.67,31.2) v2(60.67,30.47) v2(60.67,29.73) v2(61.18,50.57) v2(61.18,49.84) v2(61.18,49.1) v2(61.18,31.2) v2(61.18,30.47) v2(61.18,29.73)
(no net):
  vias: v1(8.1,21.9) v1(8.1,18.6) v1(8.1,3.4) v1(9.3,21.9) v1(9.3,18.6) v1(9.3,3.4) v1(10.5,21.9) v1(10.5,18.6) v1(10.5,3.4)
CAN1_H: length 9.5
  Top Layer w0.254: F1.2 81.79,52.7 82.27,52.23 86.45,52.23 86.72,52.49 86.72,53.27 87.14,53.7 89.03,53.7
CAN1_L: length 8.4
  Top Layer w0.254: F2.2 81.79,51.4 82.27,51.87 86.94,51.87 87.61,51.2 89.5,51.2
CAN2_H: length 11.4
  Top Layer w0.254: F3.2 81.79,48.41 82.47,47.73 82.47,45.75 82.8,45.42 86.79,45.42 87.58,46.2 89.5,46.2
CAN2_L: length 9.8
  Top Layer w0.254: F4.2 81.79,45.92 82.66,45.06 86.66,45.06 86.84,44.88 86.84,44.5 87.64,43.7 89.5,43.7
CAN_5V: length 35.4
  Top Layer w0.152: 75.05,51.48 75.05,51.12 74.81,50.88 72.26,50.88 72.05,51.09 v2(71.65,51.09) ; 67.39,52.97 66.27,52.97 66.08,53.16 66.08,56.58 66.27,56.78 67.39,56.78 ; v2(72.03,46.68) 72.42,46.68 72.52,46.58 74.81,46.58 75.05,46.82 75.05,47.18
  Top Layer w0.254: v2(71.09,47.09) C13.1 ; U1.3 v2(71.65,52.13) 71.27,52.13 C12.1 71.09,51.99 70.54,52.55 v2(70.54,53.05) ; 71.03,47.65 71.21,47.83 v2(71.65,47.83) U2.3 ; v2(71.65,51.09) 70.3,51.09 v2(69.93,51.46) ; v2(68.91,51.46) 68.42,51.46 C16.2 68.35,50.04 U4.4 ; 67.39,56.78 68.81,56.78 C14.1 70.55,55.03 70.55,53.94 v2(70.54,53.93)
  Bottom Layer w0.152: v2(71.65,47.83) 72.03,47.44 v2(72.03,46.68)
  Bottom Layer w0.254: v2(69.93,51.46) 68.93,51.46 68.91,51.43 ; v2(70.54,53.05) v2(70.54,53.93) ; v2(71.09,47.09) 70.96,47.22 70.96,48.77 70.77,48.96 68.94,48.96 v2(68.8,49.1) ; v2(71.65,52.13) v2(71.65,51.09)
  vias: v2(68.29,50.57) v2(68.29,49.84) v2(68.29,49.1) v2(68.8,50.57) v2(68.8,49.84)
CAN_G: length 27.5
  Top Layer w0.254: v2(70.05,54.41) 68.94,55.52 C14.2 68.44,56.14 67.39,56.14 ; 73.58,48.48 73.58,49.13 U2.8 ; 73.58,48.48 v2(73.58,48.15) ; 73.58,48.48 U2.2 71.21,48.48 71.03,48.65 ; v2(66.22,52.33) 67.39,52.33 ; 73.65,52.78 73.65,53.43 U1.8 ; 73.65,52.78 U1.2 71.27,52.78 C12.2 ; 73.65,52.78 v2(73.65,52.45) ; v2(66.79,51.38) C16.1
  Top Layer w0.508: v3(82.6,48.65) 89.45,48.65 89.5,48.7 ; v3(77.86,48.15) D2.3 ; v3(77.86,52.45) D1.3
  Bottom Layer w0.508: 78.99,48.65 v3(82.6,48.65)
  vias: v2(65.75,50.57) v2(65.75,49.84) v2(65.75,49.1) v2(66.26,50.57) v2(66.26,49.84) v2(66.26,49.1) v2(73.07,49.07) v2(73.07,47.24) v2(73.13,53.37) v2(73.13,51.53) v2(74.17,53.37) v2(74.17,51.53) v2(74.1,49.07) v2(74.1,47.24)
D_1.8V: length 28.9
  Top Layer w0.254: v2(26.46,3.81) 24.94,3.81 R39.2 C54.2
  Top Layer w0.381: v2(39.56,10.1) 39.17,10.49 32.26,10.49 28.44,6.68 v2(27.25,6.68) ; v2(41.53,7.27) 42.52,6.28 P3.9 P3.10
  Bottom Layer w0.254: v2(27.25,6.68) 26.78,6.21 26.78,4.13 v2(26.46,3.81)
  Bottom Layer w0.381: v2(39.56,10.1) 41.53,8.13 v2(41.53,7.27)
D_3.3V: length 6.3
  Top Layer w0.381: P3.8 P3.7 41.25,5.81 R53.1
D_5V: length 6.1
  Top Layer w0.254: 23.68,6.63 22.84,6.63 ; v2(24.6,4.73) U21.1
  Top Layer w0.508: 22.84,6.63 C52.2 20.66,6.63
  Bottom Layer w0.254: v2(23.68,6.63) 24.13,6.18 24.13,5.2 v2(24.6,4.73)
HOST_USB_DM: length 10.1
  Top Layer w0.254: 7.33,29.2 v2(7.94,29.2) ; 14.15,29.63 12.53,29.63 12.38,29.78 12.38,30.42 11.9,30.9 D4.6 11.39,30.9 10.93,30.44 10.05,30.44 9.59,30.9 D4.1 v2(8.45,30.9) ; 7.33,30.2 v2(7.94,30.2)
  Bottom Layer w0.254: v2(8.45,30.9) 7.94,30.39 v2(7.94,30.2) v2(7.94,29.2)
HOST_USB_DP: length 9
  Top Layer w0.254: 8.38,29.7 9.08,29 D4.3 9.59,29 10.05,29.46 10.93,29.46 11.39,29 D4.4 11.92,29 12.19,29.27 13.03,29.27 13.32,28.99 13.59,28.99 ; 8.38,29.7 USB1.7 ; 8.38,29.7 8.38,30.36 8.05,30.7 USB1.5
HUB1_USB_DM: length 33
  Top Layer w0.254: v2(21.47,55.33) 21.73,55.07 21.73,46.52 22.33,45.92 22.33,31.98 23.24,31.06 23.24,29.04 22.79,28.59 20.64,28.59 20.4,28.35 U19.10
  Bottom Layer w0.254: P4.12 20.57,55.33 v2(21.47,55.33)
HUB1_USB_DP: length 31.1
  Top Layer w0.254: U19.11 22.69,28.99 22.89,29.19 22.89,30.91 21.97,31.83 21.97,45.77 21.34,46.41 21.34,54.83 21.04,55.13 P4.14
J_3.3V: length 51.4
  Top Layer w0.254: 45.06,6.84 v2(77.37,6.84) ; v2(79.37,6.84) 79.66,7.13 84.77,7.13 85.33,6.58 D6.4 86.08,6.58 86.28,6.38 86.28,5.93 86.08,5.73 D6.3
  Top Layer w0.508: R52.1 43.94,9.42 45.06,8.31 P3.13 P3.14
  Bottom Layer w0.254: v2(77.37,6.84) v2(79.37,6.84)
J_5V: length 32.1
  Top Layer w0.508: v3(43.79,10.14) 43.79,10.47 v3(42.27,11.99) ; v3(39.85,11.99) 23.42,11.99 22.03,10.6 R51.1 ; v3(43.79,8.56) P3.11 P3.12
  Bottom Layer w0.508: v3(39.85,11.99) v3(42.27,11.99) ; v3(43.79,10.14) v3(43.79,8.56)
J_LED_GREEN: length 27.9
  Top Layer w0.152: P3.30 P3.29 57.14,5.7 R56.2
J_LED_RED: length 29.6
  Top Layer w0.152: R57.2 81.03,6.61 80.38,5.96 56.12,5.96 P3.27 P3.28
LED_CAN1_RX: length 1.7
  Top Layer w0.152: R2.1 U23.17
LED_CAN1_TX: length 1.9
  Top Layer w0.152: U23.16 R1.1
LED_CAN2_RX: length 4.6
  Top Layer w0.152: U23.38 57.32,47.22 57.45,47.35 57.45,50.04 57.85,50.43 R4.1
LED_CAN2_TX: length 4.2
  Top Layer w0.152: U23.37 57.36,46.72 57.76,47.12 57.76,49.43 R3.1
LED_STATUS: length 1.7
  Top Layer w0.152: R5.1 53.23,55.67 U23.51
O_3.3V: length 135.3
  Top Layer w0.254: v3(44.29,11.14) 58.05,11.14 59.24,9.96 71.93,9.96 72.51,10.53 84.87,10.53 D5.4 86.08,9.98 86.28,9.78 86.28,9.33 86.08,9.13 D5.3
  Top Layer w0.508: v3(22.81,10.29) 23.66,11.14 v3(37.2,11.14) ; v3(28.66,34.84) 28.66,31.01 16.28,18.63 v3(16.28,17.15) ; R50.1 37.7,9.42 v3(37.2,9.93) ; v3(28.66,37.27) P4.26 P4.25 ; v3(16.28,15.34) v3(16.28,8.6) v1(10.5,8.6)
  Bottom Layer w0.254: v3(37.2,11.14) v3(44.29,11.14)
  Bottom Layer w0.508: v3(28.66,37.27) v3(28.66,34.84) ; v3(37.2,9.93) v3(37.2,11.14) ; v3(16.28,8.6) 21.12,8.6 v3(22.81,10.29) ; v3(16.28,15.34) v3(16.28,17.15)
  vias: v1(8.1,8.6) v1(9.3,8.6)
O_5V: length 63.2
  Top Layer w0.508: P4.27 P4.28 v3(29.93,37.27) ; v1(10.5,4.6) 13.72,4.6 17.02,7.9 17.02,9.09 17.35,9.42 R49.1 v3(18.19,16.5) ; v3(29.93,34.84) 29.93,31.11 v3(18.19,19.37)
  Bottom Layer w0.508: v3(18.19,19.37) v3(18.19,16.5) ; v3(29.93,37.27) v3(29.93,34.84)
  vias: v1(8.1,4.6) v1(9.3,4.6)
O_LED_GREEN: length 31.9
  Top Layer w0.152: R54.2 78.17,6.21 55.11,6.21 P3.25 P3.26
O_LED_RED: length 33.5
  Top Layer w0.152: R55.2 77.53,6.47 54.09,6.47 P3.23 P3.24
O_VOUT: length 54.6
  Top Layer w0.508: P4.29 P4.30 v3(31.2,37.27) ; v1(10.5,12.6) 12.63,12.6 31.2,31.18 v3(31.2,34.84)
  Bottom Layer w0.508: v3(31.2,37.27) v3(31.2,34.84)
  vias: v1(8.1,12.6) v1(9.3,12.6)
R_3.3V: length 34
  Top Layer w0.152: v2(20.96,43.38) 20.96,42.87 15.48,37.39 3.61,37.39 2.85,38.15 2.85,38.25
  Top Layer w0.254: C45.2 25.88,49.28 25.24,48.64 U18.13 23.56,48.64 23.12,48.2 v2(23.12,47.7) ; v2(23.12,46.1) 24.28,46.1 24.28,45.28 24.67,44.89 C46.1
  Bottom Layer w0.152: v2(20.96,43.38) 23.12,45.54 v2(23.12,46.1)
  Bottom Layer w0.254: v2(23.12,46.1) v2(23.12,47.7)
R_CD: length 5
  Top Layer w0.254: 20.61,53.7 19.93,53.7 R34.1 19.05,52.82 CARD1.CD
R_USB_DM: length 12.1
  Top Layer w0.254: v2(22.21,54.48) 22.57,54.48 25.37,51.67 25.37,50.74 25.17,50.54 24.29,50.54 U18.16
  Bottom Layer w0.254: P4.8 17.96,55.4 18.73,55.4 19.65,54.48 v2(22.21,54.48)
R_USB_DP: length 12
  Top Layer w0.254: v2(22.48,54.9) 22.65,54.9 25.73,51.82 25.73,50.6 25.05,49.91 U18.15
  Bottom Layer w0.254: P4.10 19.72,54.9 v2(22.48,54.9)
RS232_RXD: length 9.3
  Top Layer w0.254: F5.2 81.79,26.91 82.93,25.78 85.35,25.78 87.43,23.7 89.5,23.7
RS232_TXD: length 9.3
  Top Layer w0.254: 89.5,26.2 87.46,26.2 85.45,28.22 83.03,28.22 81.79,29.46 F6.2
RS485_5V: length 36.1
  Top Layer w0.178: C40.1 75.08,44.01 75.52,44.45 77.53,44.45 R30.2 ; R32.2 77.53,39.23 75.52,39.23 75.08,38.79 C41.1
  Top Layer w0.254: 69.04,37.43 68.91,37.56 U7.16 66.69,37.56 66.52,37.39 66.52,33.8 66.01,33.29 66.01,32.87 66.27,32.62 67.84,32.62 C31.2 ; C31.2 71.52,32.11 v2(74.62,35.21) ; C31.2 68.35,30.67 U8.4 ; U13.8 v2(75.02,38) C41.1 74.96,38.79 74.62,39.13 v2(74.62,40.44) ; C40.1 v2(75.02,43.22) U12.8
  Bottom Layer w0.254: v2(74.62,40.44) 74.62,42.82 v2(75.02,43.22) ; v2(75.02,38) 74.62,37.59 v2(74.62,35.21)
  vias: v2(68.29,31.2) v2(68.29,30.47) v2(68.29,29.73) v2(68.8,31.2) v2(68.8,30.47) v2(68.8,29.73)
RS485_A1: length 8.6
  Top Layer w0.254: 89.5,41.2 87.55,41.2 86.74,42.02 82.62,42.02 81.79,42.84 F10.2
RS485_A2: length 14.4
  Top Layer w0.254: 89.5,33.7 87.7,33.7 86.94,32.94 86.94,32.13 86.63,31.82 82.89,31.82 82.47,32.24 82.47,36.17 81.79,36.85 F12.2
RS485_B1: length 10.5
  Top Layer w0.254: F9.2 81.79,40.88 82.58,41.66 86.3,41.66 86.67,41.29 86.67,40.82 86.95,40.53 86.95,39.39 87.64,38.7 89.5,38.7
RS485_B2: length 11.2
  Top Layer w0.254: F11.2 81.79,34.41 82.12,34.09 82.12,32.09 82.74,31.46 89.24,31.46 89.5,31.2
RS485_G: length 20
  Top Layer w0.254: v2(66.44,33.11) U7.9 ; v2(73.46,44.01) C40.2 ; v2(66.79,32.11) C31.1 ; v2(74.13,40.94) 74.19,40.88 U12.5 ; v2(78.53,39.68) R31.1 ; v2(78.53,34.47) R33.1 ; U13.5 74.19,35.65 v2(74.13,35.71) ; v2(73.46,38.79) C41.2 ; v2(69.6,36.42) C33.2
  Top Layer w0.508: v3(78.09,36.63) U17.3 ; v3(79.75,39.24) 82.08,39.24 82.87,38.46 86.35,38.46 87.6,37.21 87.6,36.71 88.11,36.2 89.5,36.2 ; v3(77.86,41.86) U16.3
  Bottom Layer w0.508: 79.2,39.24 v3(79.75,39.24)
  vias: v2(65.75,31.2) v2(65.75,30.47) v2(65.75,29.73) v2(66.26,31.2) v2(66.26,30.47) v2(66.26,29.73) v2(73.09,42.77) v2(73.09,40.94) v2(73.09,37.54) v2(73.09,35.71) v2(73.61,41.86) v2(73.61,36.63) v2(74.13,42.77) v2(74.13,37.54)
U_3.3V: length 154.6
  Top Layer w0.152: v2(84.84,37) 85.21,37 85.46,36.75 ; 85.46,26.55 85.21,26.8 v2(84.84,26.8) ; v2(84.84,33.6) 85.21,33.6 85.46,33.35 ; v2(84.84,30.2) 85.21,30.2 85.46,29.95 ; v2(84.84,40.4) 85.21,40.4 85.46,40.15
  Top Layer w0.254: v2(45.23,19.01) 45.5,19.01 46.02,19.53 C36.1 U9.16 ; 72.03,14.55 72.03,13.46 71.19,12.62 U11.1 71.1,12.62 C35.2 69.98,12.74 v2(69.98,13.29) ; 72.03,14.55 73.01,14.55 ; 72.03,14.55 72.03,15.2 ; v2(84.84,23.15) 85.45,23.15 85.46,23.15 85.46,16.35 ; 72.03,15.2 72.97,16.13 74.32,16.13 76.54,18.34 76.54,23.68 ; 72.03,15.2 U10.1 71.1,15.2 C34.2 ; 47.73,34.54 52.16,34.54 v2(52.18,34.57) 52.43,34.32 52.43,33.88 52.93,33.38 52.93,28.58 53.23,28.27 U6.24 53.23,26.15 ; 47.73,34.54 47.73,30.86 47.43,30.57 U6.9 45.38,30.57 44.44,29.62 ; 47.73,34.54 47.73,36.06 U6.48 47.73,37.49 ; 73.63,24.79 75.42,24.79 76.54,23.68 ; v2(59.07,36.54) 58.21,36.54 56.23,34.57 ; C20.2 44.42,29.62 45.73,28.31 45.73,22.17 43.94,20.38 43.94,18.85 v2(44.5,18.29) 44.71,18.08 49.11,18.08 51.24,15.95 55.8,15.95 v2(57.05,14.7) ; v2(53.69,34.57) U6.36 56.14,34.57 ; v2(61.32,15.37) 67.39,15.37 67.77,14.99 67.77,13.94 68.42,13.29 v2(69.2,13.29) ; v2(59.86,37.32) 60.31,37.32 C25.2 60.55,37.56 U7.1 ; 76.54,23.68 77.65,24.79 U5.20 C19.2 80.52,25.81 80.95,26.24 80.95,27.89 81.25,28.19 82.37,28.19 82.98,27.58 84.06,27.58 v2(84.84,26.8) ; R8.2 44.28,29.62
  Top Layer w0.381: v2(43.71,17.5) 41.7,15.48 R48.1
  Bottom Layer w0.254: v2(59.07,36.54) 59.83,37.3 59.86,37.3 ; v2(57.05,14.7) 57.05,14.71 58.98,14.71 59.36,15.09 59.36,15.45 59.79,15.88 60.81,15.88 v2(61.32,15.37) ; v2(43.71,17.5) v2(44.5,18.29) v2(45.23,19.01) ; v2(84.84,40.4) 85,40.24 85,23.3 v2(84.84,23.15) ; v2(52.18,34.57) v2(53.69,34.57) ; v2(69.98,13.29) 69.23,13.29 69.2,13.27
U_5V: length 71.2
  Top Layer w0.254: v2(42.32,14.5) v2(54.41,14.5) ; v2(57.23,20.93) 57.23,29.97 59.05,31.8 61.48,31.8 62.08,31.2 v2(63.21,31.2) 63.27,31.26 C26.2 ; v2(55.42,15.51) 57.1,13.84 57.1,12.19 57.43,11.86 v2(59.74,11.86) ; v2(39.85,14.5) 24.26,14.5 20.75,11 R47.1 ; v2(60.68,11.86) C42.1 60.75,12.42 61.1,12.76 U24.8
  Bottom Layer w0.254: v2(57.23,20.93) 55.42,19.13 v2(55.42,15.51) v2(54.41,14.5) ; v2(39.85,14.5) v2(42.32,14.5) ; v2(60.68,11.86) v2(59.74,11.86)
  vias: v2(63.21,30.47) v2(63.21,29.73) v2(63.72,31.2) v2(63.72,30.47) v2(63.72,29.73)
U_RST: length 4.7
  Top Layer w0.152: R8.1 43.93,30.98 42.92,30.98 42.47,30.52 C22.2
  Top Layer w0.254: R8.1 44.44,30.51 45.49,31.57 U6.7
U_USB_DM: length 46.7
  Top Layer w0.254: 14.15,28.35 14.96,28.35 16.1,27.2 22.12,27.2 23.8,28.88 23.8,33.53 26.01,35.74 33.89,35.74 36.09,37.94 45.13,37.94 46.59,39.4 48.23,39.4 50.73,36.89 U6.42
U_USB_DP: length 45.9
  Top Layer w0.254: 14.15,27.71 15.09,27.71 15.96,26.85 22.27,26.85 24.16,28.73 24.16,33.38 26.16,35.38 34.04,35.38 36.23,37.58 45.28,37.58 46.74,39.04 48.08,39.04 50.23,36.89 U6.43
U_VBUS: length 20.2
  Top Layer w0.254: R42.1 10.05,32.23 9.57,32.71 8.36,32.71 v3(7.96,32.31) ; v3(7.96,27.59) 8.36,27.19 9.57,27.19 10.05,27.67 R41.1
  Top Layer w0.482: v3(7.38,25.93) U22.1
  Top Layer w0.508: USB1.11 v3(7.96,27.59) ; D4.5 v3(10.78,29.95) ; USB1.2 v3(7.96,32.31)
  Bottom Layer w0.508: 7.38,27.59 v3(7.96,27.59) 8.77,27.59 10.78,29.61 v3(10.78,29.95) ; 7.38,27.59 v3(7.38,25.93) ; 7.38,27.59 7.38,31.73 v3(7.96,32.31)
U_VIO: length 24.3
  Top Layer w0.152: R24.1 59.77,13.31 60.17,12.9 60.17,11.74 60.55,11.35 61.83,11.35 62.72,10.47 67.16,10.47 67.74,11.05 R28.1
  Top Layer w0.178: 74.5,13.14 75.28,13.14 75.9,12.51 R29.1 ; 74.5,13.14 74.5,14.73 74.04,15.19 ; 74.5,13.14 C38.2
  Top Layer w0.254: C39.2 67.97,11.21 R28.1 67.85,11.05 68.15,10.74 71.77,10.74 72.06,11.03 72.06,11.85 72.83,12.62 73.97,12.62 C38.2 ; 73.01,15.2 74,15.2 C37.2
U_VREF_PWM: length 15.2
  Top Layer w0.152: v2(52.74,6.39) P3.21 P3.22 ; R20.1 R19.1 57.67,13.3 57.67,13.3 v2(57.67,12.31) ; v2(57.67,10.69) 54.26,7.28 v2(53.63,7.28)
  Bottom Layer w0.152: v2(52.74,6.39) v2(53.63,7.28) ; v2(57.67,10.69) v2(57.67,12.31)
U_XI: length 6.4
  Top Layer w0.254: U6.5 45.46,32.57 44.92,33.11 44.92,33.81 44.52,34.21 C18.1 44.11,33.88 42.37,33.88 41.44,34.81
U_XO: length 3.8
  Top Layer w0.254: 43.19,32.61 43.79,33.21 C17.2 44.44,33.09 45.46,32.07 U6.6
UART0_RTC: length 11.3
  Top Layer w0.152: U6.39 R17.2 53.21,37.51 53.8,36.92 U7.2
UART0_RTC1: length 9.8
  Top Layer w0.152: U12.2 71.74,42.18 71.63,42.06 71.63,41.53 ; 71.63,41.53 U12.3 ; 71.63,41.53 71.63,40.54 71.94,40.22 71.94,38.59 70.28,36.92 U7.15
UART0_RXD: length 52.4
  Top Layer w0.152: U7.6 v2(59.63,34.38) ; v2(57.61,15.88) 58.07,15.88 58.19,16 71.83,16 73,17.17 74.55,17.17 75.7,18.32 75.7,22.47 74.68,23.49 73.63,23.49 ; v2(58.29,33.96) 56.4,32.07 U6.31 54.09,32.07 53.8,31.78 53.8,28.88 56.82,25.87 56.82,19.26 v2(57.18,18.89)
  Bottom Layer w0.152: v2(57.61,15.88) 57.18,16.3 v2(57.18,18.89) ; v2(59.63,34.38) 58.72,34.38 v2(58.29,33.96)
UART0_RXD1: length 12.1
  Top Layer w0.152: U7.11 69.7,34.38 v2(70.33,35.02) ; v2(71.04,36.75) v2(70.33,36.04) ; U12.1 71.71,42.83 71.27,42.39 71.27,40.36 71.56,40.07 v2(71.56,38.76)
  Bottom Layer w0.152: v2(71.56,38.76) 71.56,37.85 71.04,37.32 71.04,36.75 ; v2(70.33,36.04) v2(70.33,35.02)
UART0_TXD: length 52.7
  Top Layer w0.152: v2(58.42,15.62) 59.69,15.62 59.82,15.75 71.93,15.75 73.1,16.92 74.68,16.92 75.95,18.19 75.95,22.88 74.71,24.12 73.66,24.12 73.63,24.14 ; U7.3 61.24,36.29 60.51,35.56 59.64,35.56 58.69,34.61 58.69,33.81 v2(56.94,32.06) 56.44,31.57 U6.30 ; v2(57.69,29.75) v2(57.69,18.9)
  Bottom Layer w0.152: v2(57.69,29.75) 57.69,31.31 v2(56.94,32.06) ; v2(57.69,18.9) 57.69,16.36 v2(58.42,15.62)
UART0_TXD1: length 8.2
  Top Layer w0.152: U7.14 68.26,36.29 68.6,35.94 69.66,35.94 72.2,38.48 U12.4
UART1_RTC: length 20.9
  Top Layer w0.152: v2(55.84,30.05) 56.8,30.05 59.39,32.64 62.65,32.64 62.9,32.9 62.9,35.26 62.51,35.65 U7.4 ; R18.2 U6.18 50.23,29.34 50.94,30.05 v2(52.49,30.05)
  Bottom Layer w0.152: v2(52.49,30.05) v2(55.84,30.05)
UART1_RTC1: length 6
  Top Layer w0.152: U13.2 71.74,36.95 71.63,36.84 71.63,36.3 ; 71.63,36.3 70.98,35.65 U7.13 ; 71.63,36.3 U13.3
UART1_RXD: length 64.8
  Top Layer w0.152: v2(55.84,30.56) 56.7,30.56 59.88,33.75 U7.7 ; 73.63,22.19 74.65,22.19 75.19,21.65 75.19,18.53 74.34,17.68 72.79,17.68 71.62,16.51 51.47,16.51 49.35,18.64 45.07,18.64 44.5,19.2 44.5,20.15 46.29,21.94 46.29,25.25 47.73,26.7 U6.13 47.73,29 49.29,30.56 v2(52.49,30.56)
  Bottom Layer w0.152: v2(52.49,30.56) v2(55.84,30.56)
UART1_RXD1: length 7.4
  Top Layer w0.152: U7.10 69.97,33.75 v2(71.42,35.2) ; U13.1 71.79,37.6 71.42,37.23 v2(71.42,37.17)
  Bottom Layer w0.152: v2(71.42,37.17) v2(71.42,35.2)
UART1_TXD: length 68.6
  Top Layer w0.152: v2(52.49,31.07) 49.31,31.07 47.31,29.07 U6.12 46.03,29.07 46.03,22.04 44.25,20.26 44.25,19.1 44.96,18.38 49.24,18.38 51.37,16.26 71.72,16.26 72.89,17.42 74.44,17.42 75.44,18.43 75.44,22.08 74.68,22.84 73.63,22.84 ; v2(55.84,31.07) 56.57,31.07 59.11,33.61 59.11,34.53 59.6,35.02 U7.5
  Bottom Layer w0.152: v2(52.49,31.07) v2(55.84,31.07)
UART1_TXD1: length 4.9
  Top Layer w0.152: U13.4 71.34,35.65 71.09,35.4 69.99,35.4 69.61,35.02 U7.12
UART2_RXD: length 41.8
  Top Layer w0.152: U6.22 52.23,25.97 50.66,24.4 50.05,24.4 49.78,24.12 ; 49.78,24.12 U9.9 ; 49.78,24.12 50.11,23.78 50.11,18.59 51.68,17.02 71.41,17.02 72.58,18.19 74.13,18.19 74.68,18.74 74.68,20.8 74.59,20.89 73.63,20.89
UART2_TXD: length 46.8
  Top Layer w0.152: U6.21 51.73,25.83 50.56,24.65 49.92,24.65 49.79,24.51 46.79,24.51 46.54,24.27 46.54,23.78 46.85,23.47 U9.10 49.35,23.47 49.86,22.96 49.86,18.48 51.58,16.76 71.51,16.76 72.68,17.93 74.23,17.93 74.94,18.64 74.94,21.25 74.64,21.54 73.63,21.54
UART3_RXD: length 54.9
  Top Layer w0.152: 73.63,19.59 v2(72.47,19.59) 72.09,19.22 72.09,18.06 71.3,17.27 51.79,17.27 50.37,18.69 50.37,23.3 52.7,25.63 53.58,25.63 53.73,25.78 53.73,28.21 53.23,28.7 53.23,33.51 52.73,34.01 U6.38 ; v2(70.05,14.65) 69.6,14.21 69.6,11.77 69.16,11.32 R23.1
  Bottom Layer w0.152: v2(72.47,19.59) 72.08,19.21 72.08,16.69 v2(70.05,14.65)
UART3_TXD: length 53.1
  Top Layer w0.152: U6.37 53.23,33.97 53.55,33.65 53.55,28.76 53.98,28.32 53.98,25 53.57,24.59 52.02,24.59 50.62,23.19 50.62,18.8 51.89,17.53 71.2,17.53 71.83,18.16 71.83,19.61 v2(72.47,20.24) 73.63,20.24 ; v2(69.53,14.67) 69.1,14.24 R22.1
  Bottom Layer w0.152: v2(69.53,14.67) 71.83,16.97 71.83,19.61 v2(72.47,20.24)
UART_RXD: length 8.2
  Top Layer w0.254: 89.5,16.2 87.57,16.2 86.3,14.93 F8.2
UART_TXD: length 10.8
  Top Layer w0.254: F7.2 81.79,17.16 83.44,15.52 85.95,15.52 86.31,15.88 86.31,17.35 87.66,18.7 89.5,18.7
V_3.3V: length 141.8
  Top Layer w0.152: 85.45,46.95 85.2,47.2 v2(84.84,47.2) ; v2(84.84,50.6) 85.2,50.6 85.45,50.35 ; 56.98,56.11 58.34,56.11 v2(58.94,55.51) ; U3.7 63.2,52.97 63.4,53.16 63.4,56.19 ; 85.45,53.75 85.2,54 v2(84.84,54) ; v2(84.84,43.8) 85.2,43.8 85.45,43.55
  Top Layer w0.254: v2(58.94,54.64) R7.2 ; P1.1 39.87,53.43 42.25,53.43 42.79,52.89 C1.2 42.89,52.89 43.57,52.22 U23.1 v2(45.95,52.22) 46.58,51.59 46.58,46.56 v4(46.23,46.22) U23.13 42.92,46.22 C5.2 ; 57.93,53.22 C4.2 U23.48 55.27,52.22 55.19,52.14 54.84,52.14 54.76,52.22 47.51,52.22 v2(46.73,53) U23.64 ; v2(48.29,41.04) C2.1 U23.19 v4(47.73,44.1) 53.94,44.1 54.23,43.81 U23.32 C3.2 ; v2(58.94,55.51) R6.2 59.54,55.51 60.01,55.98 60.01,56.35 60.44,56.78 C11.2 62.08,56.78 U3.1 62.82,56.78 v2(63.39,56.21)
  Top Layer w0.381: R46.1 40.42,28.98 38.86,30.53 38.86,36.37 39.22,36.73 45.75,36.73 46.63,37.61 v2(46.63,38.28)
  Bottom Layer w0.254: v4(47.73,44.1) 47.73,44.71 v4(46.23,46.22) ; v2(84.84,43.8) 84.99,43.96 84.99,53.84 v2(84.84,54) 84.84,56.08 83.84,57.07 64.25,57.07 v2(63.39,56.21) ; v2(58.94,55.51) v2(58.94,54.64) 57.93,53.63 v2(57.93,53.23) ; v2(45.95,52.22) v2(46.73,53)
  Bottom Layer w0.381: v2(48.29,41.04) 46.63,39.39 v2(46.63,38.28)
V_5V: length 77.6
  Top Layer w0.254: U4.2 63.27,50.04 C15.2 62.75,51.89 61.04,51.89 60.12,50.98 60.12,49.84 59.31,49.02 58.76,49.02 58.39,48.66 58.39,43.1 54.58,39.29 v2(49.07,39.29) ; R45.1 19.47,10.45 24.05,15.04 33.17,15.04 34.52,16.38 34.52,33.22 38.52,37.23 v2(45.55,37.23)
  Bottom Layer w0.254: v2(49.07,39.29) 47,37.23 v2(45.55,37.23)
  vias: v2(63.21,50.57) v2(63.21,49.84) v2(63.21,49.1) v2(63.72,50.57) v2(63.72,49.84) v2(63.72,49.1)
V_CAN1_RX: length 15.9
  Top Layer w0.152: U23.61 48.23,53.11 48.78,52.57 v2(55.02,52.57) ; U3.5 61.37,54.24 61.03,53.9 56.36,53.9 v2(55.8,53.34)
  Bottom Layer w0.152: v2(55.02,52.57) 55.03,52.57 v2(55.8,53.34)
V_CAN1_RX1: length 6.8
  Top Layer w0.152: 72.25,51.48 72.24,51.47 70.63,51.47 70.15,51.94 70.15,53.29 69.21,54.24 67.39,54.24
V_CAN1_TX: length 17.4
  Top Layer w0.152: U3.3 60.5,55.51 ; U23.62 47.73,55.35 49.12,56.74 55.99,56.74 56.24,56.49 56.24,55.74 56.89,55.08 60.01,55.08 60.44,55.51 R6.1
V_CAN1_TX1: length 5.7
  Top Layer w0.152: U1.1 71.42,53.43 71.42,53.43 70.5,53.43 68.78,55.14 68.53,55.14 68.16,55.51 67.39,55.51
V_CAN2_RX: length 13.3
  Top Layer w0.152: U3.6 56.73,53.6 56.07,52.94 50.38,52.94 50.23,53.1 U23.57
V_CAN2_RX1: length 9.6
  Top Layer w0.152: 67.39,53.6 68.77,53.6 69.28,53.09 69.28,50.91 v2(70.74,49.45) ; v2(71.6,47.18) U2.4
  Bottom Layer w0.152: v2(70.74,49.45) 71.27,48.92 71.27,47.51 v2(71.6,47.18)
V_CAN2_TX: length 15.3
  Top Layer w0.152: U3.4 60.82,54.87 60.58,54.64 R7.1 60.07,54.21 55.95,54.21 54.77,55.39 53.7,55.39 53.57,55.53 53.57,56.13 53.44,56.26 50.62,56.26 49.73,55.37 U23.58
V_CAN2_TX1: length 8.7
  Top Layer w0.152: U2.1 71.6,49.13 69.54,51.19 69.54,53.37 v2(69.06,53.85) ; 67.39,54.87 68.52,54.87 v2(68.76,54.64)
  Bottom Layer w0.152: v2(68.76,54.64) 69.06,54.34 v2(69.06,53.85)
V_RST: length 12.6
  Top Layer w0.152: v2(46.1,51) 46.1,49.38 45.94,49.22 U23.7 43.58,49.22 43.43,49.07 43.43,47.57 42.91,47.05 C10.1
  Bottom Layer w0.152: P1.5 43.56,51.84 44.4,51 v2(46.1,51)
V_SWC: length 15.5
  Top Layer w0.152: U23.49 v2(54.84,54.21) ; P1.4 43.44,53.67 45.45,53.67 47.42,51.7 v2(52.33,51.7)
  Bottom Layer w0.152: v2(54.84,54.21) v2(52.33,51.7)
V_SWD: length 16.7
  Top Layer w0.152: P1.3 41.96,53.88 42.6,53.88 43.06,53.42 45.34,53.42 47.55,51.22 U23.46
V_USB_DM: length 52.9
  Top Layer w0.254: v2(22.8,36.3) 22.88,36.38 33.73,36.38 35.89,38.53 41.16,38.53 48.35,45.72 U23.35 ; 14.15,30.91 13.08,30.91 12.93,31.07 12.93,34.67 14.63,36.38 21.11,36.38 v2(21.19,36.3)
  Bottom Layer w0.254: v2(22.8,36.3) 22.72,36.38 21.27,36.38 v2(21.19,36.3)
V_USB_DP: length 54.2
  Top Layer w0.254: 14.15,30.27 13.22,30.27 12.57,30.92 12.57,34.82 14.49,36.73 21.11,36.73 v2(21.19,36.8) ; v2(22.8,36.8) 22.88,36.73 33.59,36.73 35.74,38.89 41.02,38.89 48.22,46.09 55.21,46.09 55.33,46.22 U23.36
  Bottom Layer w0.254: v2(21.19,36.8) 21.26,36.73 22.73,36.73 v2(22.8,36.8)
$1N3069: length 2
  Top Layer w0.254: USB1.10 8.5,28.2 9.03,27.67 R41.2
$1N3071: length 2.2
  Top Layer w0.254: R42.2 9.03,32.23 8,31.2 USB1.4
$1N5971: length 1.9
  Top Layer w0.152: D5.2 83.95,9.1 R54.1
$1N5973: length 1.9
  Top Layer w0.152: D5.1 83.95,10.01 R55.1
$1N6094: length 1.9
  Top Layer w0.152: D6.1 83.95,6.61 R57.1
$1N6096: length 1.9
  Top Layer w0.152: D6.2 83.95,5.7 R56.1
$1N11841: length 3.1
  Top Layer w0.254: 22.81,4.73 22.81,3.66 R40.2 R39.1 C54.1
$1N12310: length 3.1
  Top Layer w0.254: C53.1 R37.1 R38.2 31.08,3.66 31.08,4.73
$1N17961: length 1.2
  Top Layer w0.254: R44.2 9.29,24 U22.3
$1N17962: length 1.4
  Top Layer w0.254: R43.1 12.34,24.03 11.62,24.03
$3N2411: length 8.1
  Top Layer w0.254: U16.1 76.27,43.41 76.87,44.01 R30.1 ; U16.1 76.51,42.81 76.93,42.38 79.61,42.38 80.09,42.87 F10.1 ; U16.1 76.03,42.57 76.03,42 75.56,41.53 U12.6
$3N2413: length 8.2
  Top Layer w0.152: v2(75.61,42.18) U12.7
  Top Layer w0.254: 76.97,39.7 76.87,39.7 76.27,40.3 U16.2 ; F9.1 80.09,40.84 79.61,41.33 76.93,41.33 76.51,40.91 U16.2 ; U16.2 v2(76.27,41.63)
  Bottom Layer w0.254: v2(75.61,42.18) 75.73,42.18 v2(76.27,41.63)
$3N2949: length 8.1
  Top Layer w0.254: F12.1 80.09,37.64 79.61,37.16 76.93,37.16 76.51,37.58 76.27,37.58 ; U13.6 75.56,36.3 76.03,36.77 76.03,37.34 76.27,37.58 ; 76.97,38.78 76.87,38.78 76.27,38.18 76.27,37.58
$3N2961: length 8.2
  Top Layer w0.152: v2(75.61,36.95) U13.7
  Top Layer w0.254: 76.27,35.68 76.27,35.07 76.87,34.47 76.97,34.47 ; 76.27,35.68 76.51,35.68 76.93,36.1 79.61,36.1 80.09,35.61 F11.1 ; 76.27,35.68 v2(76.27,36.4)
  Bottom Layer w0.254: v2(76.27,36.4) 75.73,36.95 v2(75.61,36.95)
$3N6150: length 1.5
  Top Layer w0.254: C27.1 54.86,19.57 U9.1
$3N6154: length 6.4
  Top Layer w0.254: U9.3 52.6,20.87 52.18,20.45 52.18,19.41 52.53,19.05 55.34,19.05 C27.2
$3N6187: length 2.8
  Top Layer w0.254: C29.1 55.32,21.39 54.16,21.39 54.03,21.52 U9.4
$3N6191: length 1.6
  Top Layer w0.254: C29.2 54.62,22.17 U9.5
$3N6279: length 1.6
  Top Layer w0.254: C28.1 54.63,20.22 U9.2
$3N6283: length 1.5
  Top Layer w0.254: U9.6 C30.1
$3N18347: length 45
  Top Layer w0.254: U9.7 52.3,23.47 51.56,22.73 51.56,19.15 52.25,18.47 70.81,18.47 71.07,18.72 71.07,27.58 72.24,28.75 75.62,28.75 76.24,29.38 76.69,29.38 77.11,28.96 79.78,28.96 80.27,29.45 80.27,29.68
$3N18365: length 46.4
  Top Layer w0.254: U9.8 52.24,24.12 51.11,22.99 51.11,19 52.07,18.03 70.98,18.03 71.53,18.58 71.53,27.41 72.22,28.1 75.62,28.1 76.24,27.48 76.69,27.48 77.11,27.9 79.78,27.9 80.27,27.41 80.27,27.18
$3N18967: length 16.7
  Top Layer w0.152: 83.96,40.15 84.21,39.9 v2(84.57,39.9) ; v2(82.61,25.49) 82.12,25 R9.1
  Bottom Layer w0.152: v2(84.57,39.9) 84.57,37.26 83.94,36.63 83.94,30.55 83.43,30.04 83.43,26.32 v2(82.61,25.49)
